# EAGLE schematic mcs_expansion (EAGLE 5.11)
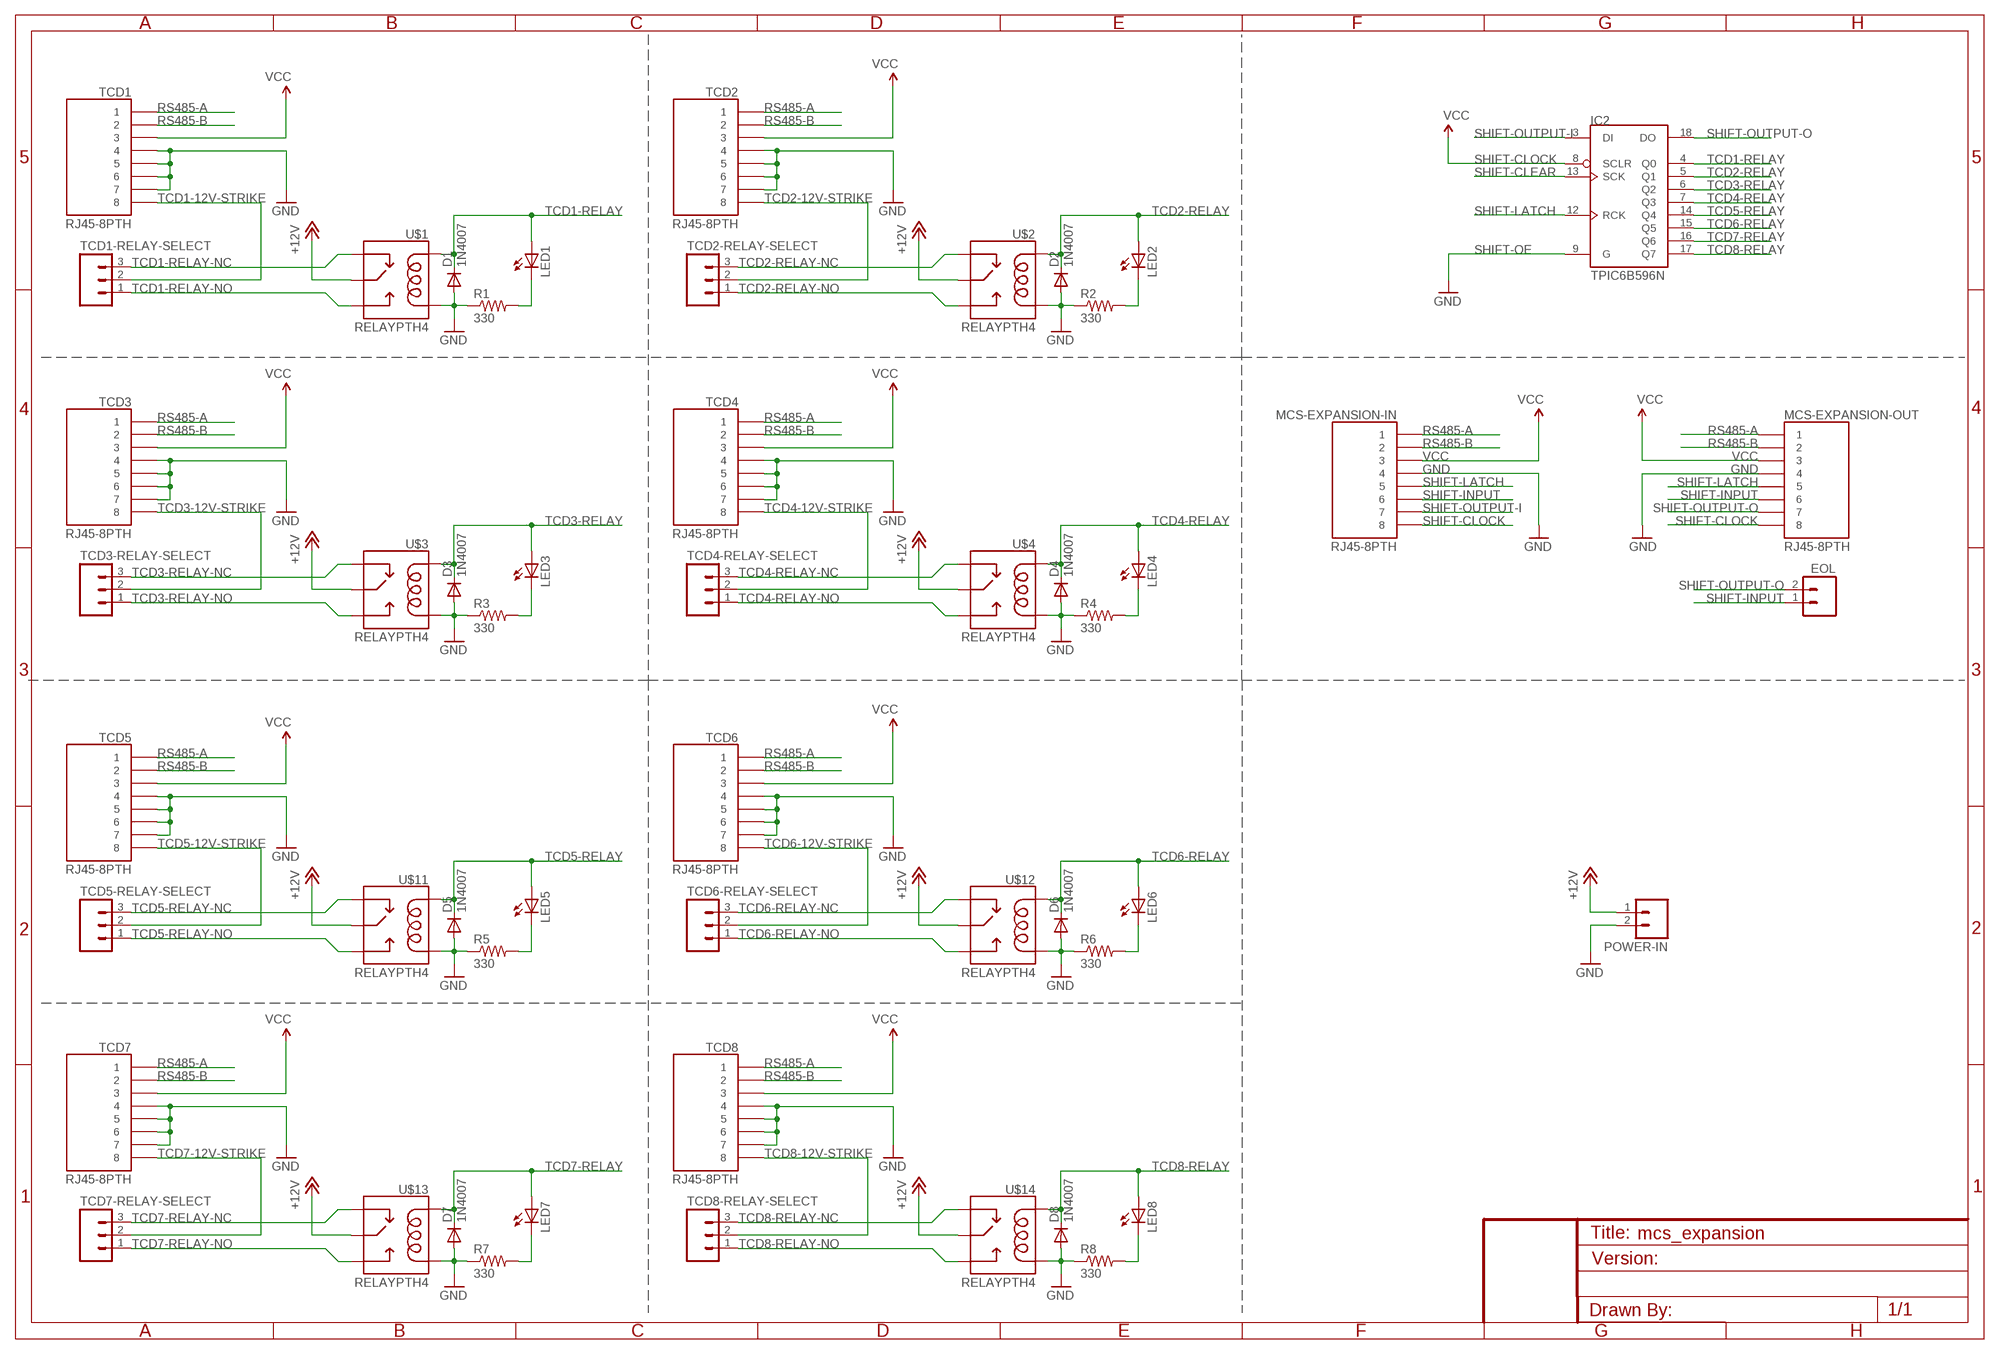
[diagram p0: schematic, sheet 1]

## Parts
D1  1N4007  DIODEPTH  [DIODE-1N4001]
D2  1N4007  DIODEPTH  [DIODE-1N4001]
D3  1N4007  DIODEPTH  [DIODE-1N4001]
D4  1N4007  DIODEPTH  [DIODE-1N4001]
D5  1N4007  DIODEPTH  [DIODE-1N4001]
D6  1N4007  DIODEPTH  [DIODE-1N4001]
D7  1N4007  DIODEPTH  [DIODE-1N4001]
D8  1N4007  DIODEPTH  [DIODE-1N4001]
EOL  M02PTH  [1X02]
IC2  TPIC6B596N  [DIL20]
LED1  LED5MM  [LED5MM]
LED2  LED5MM  [LED5MM]
LED3  LED5MM  [LED5MM]
LED4  LED5MM  [LED5MM]
LED5  LED5MM  [LED5MM]
LED6  LED5MM  [LED5MM]
LED7  LED5MM  [LED5MM]
LED8  LED5MM  [LED5MM]
MCS-EXPANSION-IN  RJ45-8PTH  [RJ45-8]
MCS-EXPANSION-OUT  RJ45-8PTH  [RJ45-8]
POWER-IN  M023.5MM  [SCREWTERMINAL-3.5MM-2]
R1  330  RESISTORPTH-1/4W  [AXIAL-0.4]
R2  330  RESISTORPTH-1/4W  [AXIAL-0.4]
R3  330  RESISTORPTH-1/4W  [AXIAL-0.4]
R4  330  RESISTORPTH-1/4W  [AXIAL-0.4]
R5  330  RESISTORPTH-1/4W  [AXIAL-0.4]
R6  330  RESISTORPTH-1/4W  [AXIAL-0.4]
R7  330  RESISTORPTH-1/4W  [AXIAL-0.4]
R8  330  RESISTORPTH-1/4W  [AXIAL-0.4]
TCD1  RJ45-8PTH  [RJ45-8]
TCD1-RELAY-SELECT  M03PTH  [1X03]
TCD2  RJ45-8PTH  [RJ45-8]
TCD2-RELAY-SELECT  M03PTH  [1X03]
TCD3  RJ45-8PTH  [RJ45-8]
TCD3-RELAY-SELECT  M03PTH  [1X03]
TCD4  RJ45-8PTH  [RJ45-8]
TCD4-RELAY-SELECT  M03PTH  [1X03]
TCD5  RJ45-8PTH  [RJ45-8]
TCD5-RELAY-SELECT  M03PTH  [1X03]
TCD6  RJ45-8PTH  [RJ45-8]
TCD6-RELAY-SELECT  M03PTH  [1X03]
TCD7  RJ45-8PTH  [RJ45-8]
TCD7-RELAY-SELECT  M03PTH  [1X03]
TCD8  RJ45-8PTH  [RJ45-8]
TCD8-RELAY-SELECT  M03PTH  [1X03]
U$1  RELAYPTH4  [RELAY-JZC]
U$2  RELAYPTH4  [RELAY-JZC]
U$3  RELAYPTH4  [RELAY-JZC]
U$4  RELAYPTH4  [RELAY-JZC]
U$11  RELAYPTH4  [RELAY-JZC]
U$12  RELAYPTH4  [RELAY-JZC]
U$13  RELAYPTH4  [RELAY-JZC]
U$14  RELAYPTH4  [RELAY-JZC]

## Nets
+12V [signal]: POWER-IN.1 U$1.4(MAIN) U$2.4(MAIN) U$3.4(MAIN) U$4.4(MAIN) U$11.4(MAIN) U$12.4(MAIN) U$13.4(MAIN) U$14.4(MAIN)
GND: D1.A D2.A D3.A D4.A D5.A D6.A D7.A D8.A IC2.9(G) MCS-EXPANSION-IN.4 MCS-EXPANSION-OUT.4 POWER-IN.2 R1.P$1 R2.P$1 R3.P$1 R4.P$1 R5.P$1 R6.P$1 R7.P$1 R8.P$1 TCD1.4 TCD1.5 TCD1.6 TCD1.7 TCD2.4 TCD2.5 TCD2.6 TCD2.7 TCD3.4 TCD3.5 TCD3.6 TCD3.7 TCD4.4 TCD4.5 TCD4.6 TCD4.7 TCD5.4 TCD5.5 TCD5.6 TCD5.7 TCD6.4 TCD6.5 TCD6.6 TCD6.7 TCD7.4 TCD7.5 TCD7.6 TCD7.7 TCD8.4 TCD8.5 TCD8.6 TCD8.7 U$1.1(COIL2) U$2.1(COIL2) U$3.1(COIL2) U$4.1(COIL2) U$11.1(COIL2) U$12.1(COIL2) U$13.1(COIL2) U$14.1(COIL2)
N$1: LED1.K(C) R1.P$2
N$2: LED2.K(C) R2.P$2
N$3: LED3.K(C) R3.P$2
N$4: LED4.K(C) R4.P$2
N$5: LED5.K(C) R5.P$2
N$6: LED6.K(C) R6.P$2
N$7: LED7.K(C) R7.P$2
N$8: LED8.K(C) R8.P$2
RS485-A: MCS-EXPANSION-IN.1 MCS-EXPANSION-OUT.1 TCD1.1 TCD2.1 TCD3.1 TCD4.1 TCD5.1 TCD6.1 TCD7.1 TCD8.1
RS485-B: MCS-EXPANSION-IN.2 MCS-EXPANSION-OUT.2 TCD1.2 TCD2.2 TCD3.2 TCD4.2 TCD5.2 TCD6.2 TCD7.2 TCD8.2
SHIFT-CLOCK: IC2.13(SCK) MCS-EXPANSION-IN.8 MCS-EXPANSION-OUT.8
SHIFT-INPUT: EOL.1 MCS-EXPANSION-IN.6 MCS-EXPANSION-OUT.6
SHIFT-LATCH: IC2.12(RCK) MCS-EXPANSION-IN.5 MCS-EXPANSION-OUT.5
SHIFT-OUTPUT-I: IC2.3(DI) MCS-EXPANSION-IN.7
SHIFT-OUTPUT-O: EOL.2 IC2.18(DO) MCS-EXPANSION-OUT.7
TCD1-12V-STRIKE: TCD1-RELAY-SELECT.2 TCD1.8
TCD1-RELAY: D1.C IC2.4(Q0) LED1.A U$1.5(COIL1)
TCD1-RELAY-NC: TCD1-RELAY-SELECT.3 U$1.2(NC)
TCD1-RELAY-NO: TCD1-RELAY-SELECT.1 U$1.3(NO)
TCD2-12V-STRIKE: TCD2-RELAY-SELECT.2 TCD2.8
TCD2-RELAY: D2.C IC2.5(Q1) LED2.A U$2.5(COIL1)
TCD2-RELAY-NC: TCD2-RELAY-SELECT.3 U$2.2(NC)
TCD2-RELAY-NO: TCD2-RELAY-SELECT.1 U$2.3(NO)
TCD3-12V-STRIKE: TCD3-RELAY-SELECT.2 TCD3.8
TCD3-RELAY: D3.C IC2.6(Q2) LED3.A U$3.5(COIL1)
TCD3-RELAY-NC: TCD3-RELAY-SELECT.3 U$3.2(NC)
TCD3-RELAY-NO: TCD3-RELAY-SELECT.1 U$3.3(NO)
TCD4-12V-STRIKE: TCD4-RELAY-SELECT.2 TCD4.8
TCD4-RELAY: D4.C IC2.7(Q3) LED4.A U$4.5(COIL1)
TCD4-RELAY-NC: TCD4-RELAY-SELECT.3 U$4.2(NC)
TCD4-RELAY-NO: TCD4-RELAY-SELECT.1 U$4.3(NO)
TCD5-12V-STRIKE: TCD5-RELAY-SELECT.2 TCD5.8
TCD5-RELAY: D5.C IC2.14(Q4) LED5.A U$11.5(COIL1)
TCD5-RELAY-NC: TCD5-RELAY-SELECT.3 U$11.2(NC)
TCD5-RELAY-NO: TCD5-RELAY-SELECT.1 U$11.3(NO)
TCD6-12V-STRIKE: TCD6-RELAY-SELECT.2 TCD6.8
TCD6-RELAY: D6.C IC2.15(Q5) LED6.A U$12.5(COIL1)
TCD6-RELAY-NC: TCD6-RELAY-SELECT.3 U$12.2(NC)
TCD6-RELAY-NO: TCD6-RELAY-SELECT.1 U$12.3(NO)
TCD7-12V-STRIKE: TCD7-RELAY-SELECT.2 TCD7.8
TCD7-RELAY: D7.C IC2.16(Q6) LED7.A U$13.5(COIL1)
TCD7-RELAY-NC: TCD7-RELAY-SELECT.3 U$13.2(NC)
TCD7-RELAY-NO: TCD7-RELAY-SELECT.1 U$13.3(NO)
TCD8-12V-STRIKE: TCD8-RELAY-SELECT.2 TCD8.8
TCD8-RELAY: D8.C IC2.17(Q7) LED8.A U$14.5(COIL1)
TCD8-RELAY-NC: TCD8-RELAY-SELECT.3 U$14.2(NC)
TCD8-RELAY-NO: TCD8-RELAY-SELECT.1 U$14.3(NO)
VCC: IC2.8(SCLR) MCS-EXPANSION-IN.3 MCS-EXPANSION-OUT.3 TCD1.3 TCD2.3 TCD3.3 TCD4.3 TCD5.3 TCD6.3 TCD7.3 TCD8.3

## Notes on the sheet
- SHIFT-CLEAR
- SHIFT-OE

## Power pins joined to a net without a drawn wire
GND: IC2.10(GND) IC2.11(GND) IC2.19(GND)
VCC: IC2.2(VCC)

## Library data of the parts
D1-D8 = SparkFun:DIODE: Diode These are standard reverse protection diodes and small signal diodes. SMA package can handle up to about 1A. SOD-323 can handle about 200mA. What the SOD-323 package when ordering, there are some mfgs out there that are 5-pin packages.
EOL POWER-IN = SparkFun:M02: Header 2 Standard 2-pin 0.1" header. Use with straight break away headers (SKU : PRT-00116), right angle break away headers (PRT-00553), swiss pins (PRT-00743), machine pins (PRT-00117), and female headers (PRT-00115). Molex polarized connector foot print use with SKU : PRT-08233 with associated crimp pins and housings.
IC2 = tpic:TPIC6B596
LED1-LED8 = SparkFun:LED: LEDs Standard schematic elements and footprints for 5mm, 3mm, 1206, and 0603 sized LEDs. 5mm - Spark Fun Electronics SKU : COM-00529 (and others)
MCS-EXPANSION-IN MCS-EXPANSION-OUT TCD1-TCD8 = SparkFun:RJ45-8: RJ45 Jack Simple RJ45, 8-pin connection - connector for common Cat5, Cat5e, and Cat6 Ethernet cables. Footprint not yet proven in production. Connector sku is PRT-00643; Breakout PCB sku is BOB-00716.
R1-R8 = SparkFun:RESISTOR: Resistor Basic schematic elements and footprints for 0603, 1206, and PTH resistors.
TCD1-RELAY-SELECT TCD2-RELAY-SELECT TCD3-RELAY-SELECT TCD4-RELAY-SELECT TCD5-RELAY-SELECT TCD6-RELAY-SELECT TCD7-RELAY-SELECT TCD8-RELAY-SELECT = SparkFun:M03: Header 3 Standard 3-pin 0.1" header. Use with straight break away headers (SKU : PRT-00116), right angle break away headers (PRT-00553), swiss pins (PRT-00743), machine pins (PRT-00117), and female headers (PRT-00115). Molex polarized connector foot print use with SKU : PRT-08232 with associated crimp pins and housings.
U$1-U$4 U$11-U$14 = SparkFun:RELAY

## Net classes
2 signal: width 0.406 mm, clearance 0.305 mm